# EasyEDA Pro project 测试用途.eprj, board PCB3
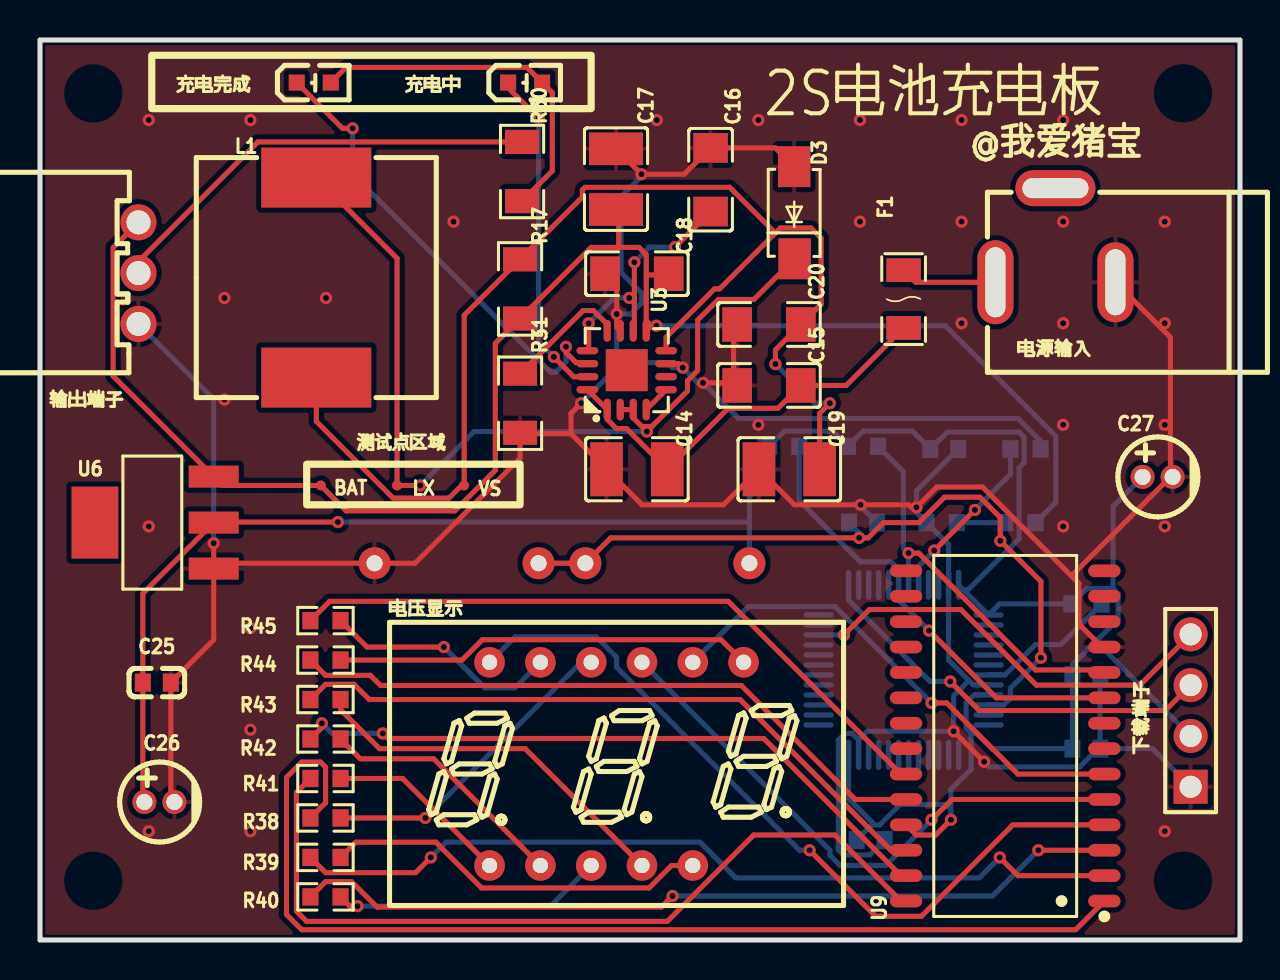
[diagram p9: board, top side]
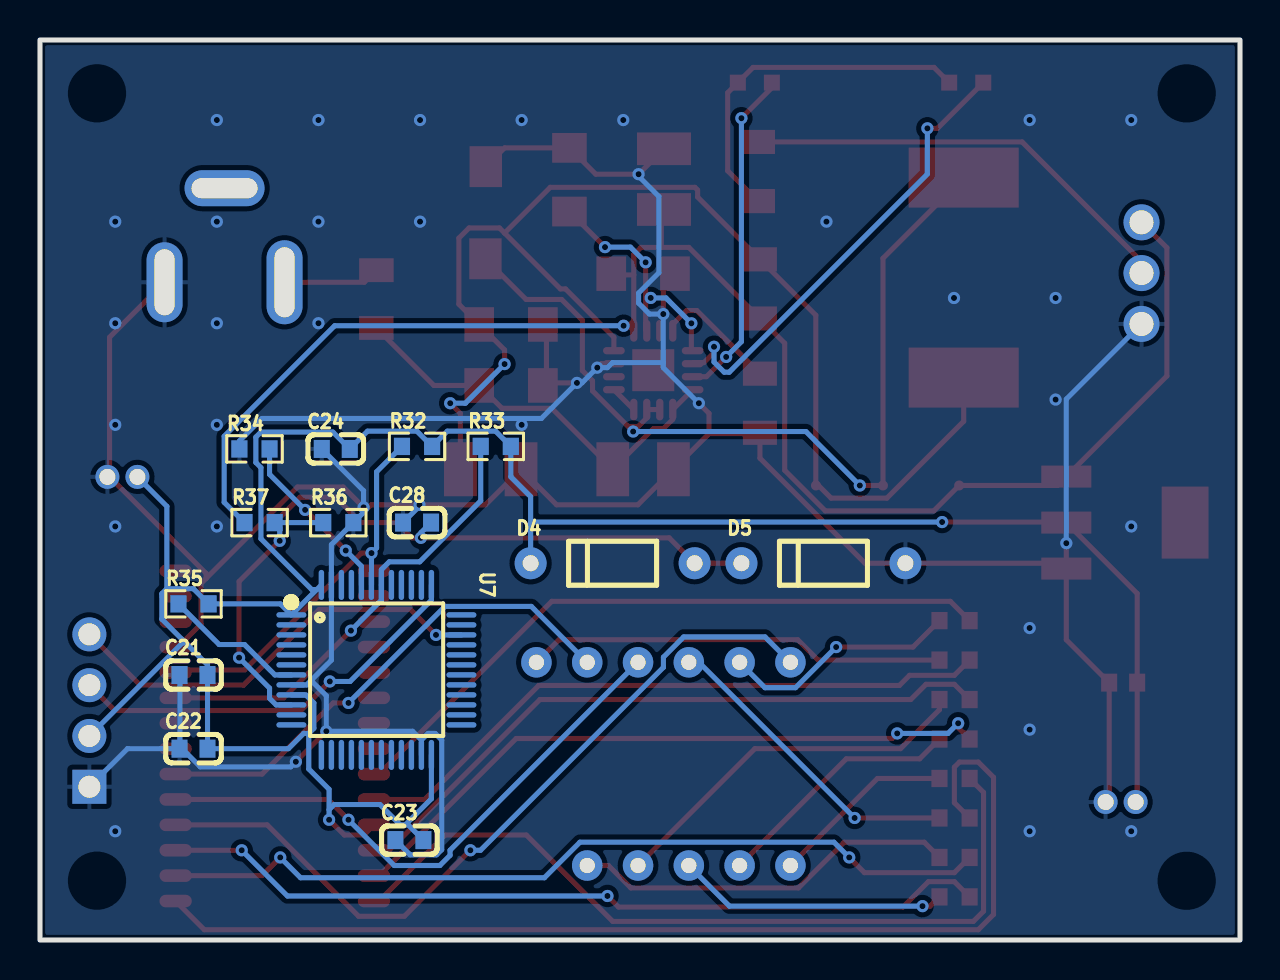
[diagram p10: board, bottom side, seen from below]

Outline 60 x 45 mm; copper layers: Top Layer, Bottom Layer. Coordinates in mm from the lower left corner of the outline.
Outline path: rectangle 0,45 60,0
Stack: Top Layer 0.035mm / Dielectric1 1.51mm FR4 er 4.5 / Bottom Layer 0.035mm

## Design rules (mm)
template: JLCPCB Capability(Two Layers Board)
spacing copperThickness1oz (default): track to track 0.102, other pairs 0.152 to 0.3
spacing copperThickness2oz: track to track 0.203, other pairs 0.152 to 0.3
track width copperThickness1oz (default): min 0.127, default 0.254, max 2.54
track width copperThickness2oz: min 0.203, default 0.254, max 2.54
differential pair differentialPair (default): width min 0.127, default 0.254, max 2.54; gap min 0.152, default 0.152
via viaSize (default): diameter min 0.5, default 0.61, max 10; hole min 0.3, default 0.305, max 6.3

## Placement (name value [footprint] x y rotation side)
BAT  -  [Test-Point-0.5mm]  14.04 22.73 180 top
C14  10UF  [C1210]  29.85 23.54 180 top
C15  100nf  [C1206]  36.45 27.73 0 top
C16  10UF  [C1206]  33.53 38.02 270 top
C17  10UF  [C1210]  28.8 38.04 90 top
C18  100nf  [C1206]  29.85 33.32 0 top
C19  10UF  [C1210]  37.47 23.54 180 top
C20  100nf  [C1206]  36.45 30.78 0 top
C21  100nF  [C0603]  52.32 13.25 180 bottom
C22  100nF  [C0603]  52.32 9.57 180 bottom
C23  100nF  [C0603]  41.53 5 180 bottom
C24  100nF  [C0603]  45.21 24.55 180 bottom
C25  100nF  [C0603]  5.84 12.87 180 top
C26  4.7uF  [CAP-TH_BD4.0-P1.50-D0.5-FD]  5.97 6.9 0 top
C27  4.7uF  [CAP-TH_BD4.0-P1.50-D0.5-FD]  55.88 23.16 0 top
C28  100nF  [C0603]  41.15 20.87 180 bottom
D3  SS14  [SMA_L4.3-W2.6-LS5.0-FD]  37.72 36.36 270 top
D4  1N4148  [DO-35_BD2.0-L4.2-P8.20-D0.5-RD]  31.37 18.84 180 bottom
D5  1N4148  [DO-35_BD2.0-L4.2-P8.20-D0.5-RD]  20.83 18.84 180 bottom
F1  SMD1206  [F1206]  43.18 32.05 90 top
L1  22uH  [IND-SMD_L12.0-W12.0_YPRH120X]  13.82 33.12 90 top
LX  -  [Test-Point-0.5mm]  17.85 22.73 90 top
R17  0.2Ω  [R1206]  24 32.55 90 top
R30  1KΩ  [R1206]  24.1 38.42 270 top
R31  50K  [R1206]  24 26.84 90 top
R32  4.7KΩ  [R0603]  41.15 24.68 180 bottom
R33  4.7KΩ  [R0603]  37.21 24.68 180 bottom
R34  10KΩ  [R0603]  49.28 24.55 180 bottom
R35  10KΩ  [R0603]  52.32 16.81 180 bottom
R36  10KΩ  [R0603]  45.08 20.87 180 bottom
R37  30KΩ  [R0603]  49.02 20.87 180 bottom
R38  200Ω  [R0603]  14.27 6.1 0 top
R39  200Ω  [R0603]  14.27 4.13 0 top
R40  200Ω  [R0603]  14.27 2.16 0 top
R41  200Ω  [R0603]  14.27 8.08 0 top
R42  200Ω  [R0603]  14.27 10.05 0 top
R43  200Ω  [R0603]  14.27 12.02 0 top
R44  200Ω  [R0603]  14.27 14 0 top
R45  200Ω  [R0603]  14.27 15.97 0 top
U3  TP5100  [TQFN-16_L4.0-W4.0-P0.65-BL-EP]  29.34 28.49 0 top
U6  AMS1117-3.3  [SOT-223-3_L6.5-W3.4-P2.30-LS7.0-BR]  5.72 20.87 0 top
U7  STM32F030C8T6TR  [LQFP-48_L7.0-W7.0-P0.50-LS9.0-BL]  43.18 13.5 270 bottom
U9  CH423S  [SOP-28_L17.9-W7.5-P1.27-LS10.3-BL]  48.26 10.2 90 top
VS  -  [Test-Point-0.5mm]  21.2 22.73 270 top
下载端子  PH2.54-01-04PZD  [HDR-TH_4P-P2.54-V-M-1]  57.53 11.47 90 top
充电中  19-217/BHC-ZL1M2RY/3T  [LED0603-R-RD]  24.26 42.87 0 top
充电完成  19-217/BHC-ZL1M2RY/3T  [LED0603-R-RD]  13.69 42.87 0 top
电压显示  FJ3361BH  [LED-SEG-TH_10P-L22.5-W14.0-P2.54-S10.16-BL]  28.83 8.81 0 top
电源输入  DC-005-5A-2.0  [DC-IN-TH_DC-005-5A-2.0]  50.77 35.24 180 top
输出端子  XH-3AW  [CONN-TH_3P-P2.54_HCTL_XH-3AW]  4.93 33.34 90 top

## Footprints (pads in the part's own frame, mm; a bottom-side part is the same pattern mirrored in y, then rotated)
C0603
  rect 0.8x0.9 smd: 1(-0.7,0) 2(0.7,0)
C1206
  rect 1.485x1.728 smd: 1(-1.593,0) 2(1.593,0)
C1210
  rect 1.635x2.7 smd: 1(-1.518,0) 2(1.518,0)
CAP-TH_BD4.0-P1.50-D0.5-FD
  round 1.2 hole 0.8: 1(-0.75,0) 2(0.75,0)
CONN-TH_3P-P2.54_HCTL_XH-3AW
  round 1.8 hole 1.199: 1(-2.54,0) 2(0.002,0) 3(2.54,0)
DC-IN-TH_DC-005-5A-2.0
  oval 1.8x4.2 hole 1x3.5: 1(3,2.352)
  oval 1.8x4 hole 1x3.3: 2(-3,2.352)
  oval 4x1.8 hole 3.3x1: 3(-0.001,-2.352)
DO-35_BD2.0-L4.2-P8.20-D0.5-RD
  round 1.6 hole 0.8: 1(-4.1,0) 2(4.1,0)
F1206
  rect 1.19x1.728 smd: 1(-1.445,0) 2(1.445,0)
HDR-TH_4P-P2.54-V-M-1
  rect 1.7x1.7 hole 1.1: 1(-3.81,0)
  round 1.7 hole 1.1: 2(-1.27,0) 3(1.27,0) 4(3.81,0)
IND-SMD_L12.0-W12.0_YPRH120X
  rect 3x5.5 smd: 1(-5,0) 2(5,0)
LED0603-R-RD
  rect 0.8x0.8 smd: 1(0.851,0) 2(-0.851,0)
LED-SEG-TH_10P-L22.5-W14.0-P2.54-S10.16-BL
  round 1.524 hole 0.762: 1(-6.35,-5.08) 2(-3.81,-5.08) 3(-1.27,-5.08) 4(1.27,-5.08) 5(3.81,-5.08) 7(6.35,5.08) 8(3.81,5.08) 9(1.27,5.08) 10(-1.27,5.08) 11(-3.81,5.08) 12(-6.35,5.08)
LQFP-48_L7.0-W7.0-P0.50-LS9.0-BL
  oval 0.27x1.5 smd: 1(-2.75,-4.25) 2(-2.25,-4.25) 3(-1.75,-4.25) 4(-1.25,-4.25) 5(-0.75,-4.25) 6(-0.25,-4.25) 7(0.25,-4.25) 8(0.75,-4.25) 9(1.25,-4.25) 10(1.75,-4.25) 11(2.25,-4.25) 12(2.75,-4.25) 25(2.75,4.25) 26(2.25,4.25) 27(1.75,4.25) 28(1.25,4.25) 29(0.75,4.25) 30(0.25,4.25) 31(-0.25,4.25) 32(-0.75,4.25) 33(-1.25,4.25) 34(-1.75,4.25) 35(-2.25,4.25) 36(-2.75,4.25)
  oval 1.5x0.27 smd: 13(4.25,-2.75) 14(4.25,-2.25) 15(4.25,-1.75) 16(4.25,-1.25) 17(4.25,-0.75) 18(4.25,-0.25) 19(4.25,0.25) 20(4.25,0.75) 21(4.25,1.25) 22(4.25,1.75) 23(4.25,2.25) 24(4.25,2.75) 37(-4.25,2.75) 38(-4.25,2.25) 39(-4.25,1.75) 40(-4.25,1.25) 41(-4.25,0.75) 42(-4.25,0.25) 43(-4.25,-0.25) 44(-4.25,-0.75) 45(-4.25,-1.25) 46(-4.25,-1.75) 47(-4.25,-2.25) 48(-4.25,-2.75)
R0603
  rect 0.806x0.864 smd: 1(-0.753,0) 2(0.753,0)
R1206
  rect 1.208x1.701 smd: 1(-1.479,0) 2(1.479,0)
SMA_L4.3-W2.6-LS5.0-FD
  rect 2.046x1.62 smd: 1(-2.304,-0.009) 2(2.304,0.009)
SOP-28_L17.9-W7.5-P1.27-LS10.3-BL
  oval 0.63x1.615 smd: 1(-8.255,-4.957) 2(-6.985,-4.957) 3(-5.715,-4.957) 4(-4.445,-4.957) 5(-3.175,-4.957) 6(-1.905,-4.957) 7(-0.635,-4.957) 8(0.635,-4.957) 9(1.905,-4.957) 10(3.175,-4.957) 11(4.445,-4.957) 12(5.715,-4.957) 13(6.985,-4.957) 14(8.255,-4.957) 15(8.255,4.957) 16(6.985,4.957) 17(5.715,4.957) 18(4.445,4.957) 19(3.175,4.957) 20(1.905,4.957) 21(0.635,4.957) 22(-0.635,4.957) 23(-1.905,4.957) 24(-3.175,4.957) 25(-4.445,4.957) 26(-5.715,4.957) 27(-6.985,4.957) 28(-8.255,4.957)
SOT-223-3_L6.5-W3.4-P2.30-LS7.0-BR
  rect 2.5x1.1 smd: 1(2.97,-2.3) 2(2.97,0) 3(2.97,2.3)
  rect 2.34x3.6 smd: 4(-2.97,0)
Test-Point-0.5mm
  round 0.5 smd: 1(0,0)
TQFN-16_L4.0-W4.0-P0.65-BL-EP
  oval 0.364x1.087 smd: 1(-0.975,-1.968) 2(-0.325,-1.968) 3(0.325,-1.968) 4(0.975,-1.968) 9(0.975,1.968) 10(0.325,1.968) 11(-0.325,1.968) 12(-0.975,1.968)
  oval 1.087x0.364 smd: 5(1.968,-0.975) 6(1.968,-0.325) 7(1.968,0.325) 8(1.968,0.975) 13(-1.968,0.975) 14(-1.968,0.325) 15(-1.968,-0.325) 16(-1.968,-0.975)
  rect 2.1x2.1 smd: 17(0,0)

## Nets
As in the schematic.

Pads without a net: U3 6 17; U6 4; U7 2 3 4 5 6 11 12 13 14 15 16 17 18 19 20 21 22 25 26 27 28 29 30 31 32 33 35 36 38 39 40 41 45 46; U9 7 8 12 13 14 15 16 17 18 19 20 21 22; 电源输入 3

## Via types
v1: diameter 0.61, hole 0.305, Top Layer to Bottom Layer, 75 vias

## Routing (per net, layer and track width the routed paths; a pad name or vN(x,y) marks a point on that pad's centre or on a via; arc(x,y) is an arc through that point)
3V3: length 128.4
  Top Layer w0.254: C26.1 5.14,6.98 C25.2 5.14,17.33 U6.2 8.71,20.9 v1(14.89,20.9) ; U9.25 43.81,5.25 44.78,5.25 v1(45.55,6.01)
  Bottom Layer w0.254: U7.24 40.43,7.06 41.73,5.76 ; 41.73,5.76 41.59,5.76 C23.2 ; 41.73,5.76 41.99,5.76 43.01,6.77 45.29,6.77 45.55,6.52 ; 52.89,15.03 52.89,14.84 57.53,10.2 ; 52.89,15.03 51.62,13.76 C21.2 C22.2 47.58,9.57 46.82,10.33 46.56,10.33 ; 52.89,15.03 53.91,16.04 53.91,17.31 53.66,17.57 ; 46.56,10.33 46.31,10.58 46.31,11.85 46.71,12.25 U7.9 ; 46.56,10.33 46.56,8.55 45.55,7.54 45.55,6.52 ; 53.66,17.57 53.66,21.68 C27.1 ; 53.66,17.57 52.33,17.57 R35.2 47.98,16.81 U7.1 46.16,17.52 ; 45.55,6.52 v1(45.55,6.01) ; 46.16,17.52 U7.48 ; 46.16,17.52 46.41,17.52 48.95,20.06 48.95,23.62 49.21,23.87 49.21,25.14 48.95,25.4 45.36,25.4 C24.2 43.62,25.44 41.16,25.44 R32.2 39.63,25.44 37.22,25.44 R33.2 36.46,23.16 35.47,22.17 35.47,20.9 ; 35.47,20.9 v1(14.89,20.9) ; 35.47,20.9 D4.1
GND: length 209.9
  Top Layer w0.254: 电源输入.2 56.52,30.14 56.52,23.16 ; 26.55,25.31 26.55,26.33 v1(27.06,26.84) ; 26.55,25.31 24.05,25.31 R31.1 24,24.09 18.75,18.84 D5.2 8.95,18.84 U6.1 ; 26.55,25.31 C14.2 30.11,21.76 34.17,21.76 C19.2 37.73,21.76 v1(41.03,21.76) 43.44,21.76 43.57,21.63 v1(43.82,21.63) 44.84,22.65 47.12,22.65 51.7,18.08 ; 51.7,18.08 51.7,18.33 56.52,23.16 ; 51.7,18.08 51.95,17.82 51.95,15.79 53.09,14.65 U9.11 ; C26.2 6.54,7.08 C25.1 8.69,15.01 U6.1 ; 56.52,23.16 C27.2 ; v1(32.14,28.62) 31.94,28.81 U3.7 ; v1(33.15,27.86) 34.68,27.86 ; 34.68,27.86 34.68,30.6 C20.1 ; 34.68,27.86 C15.1 ; C17.2 v1(30.07,38.29) 32.21,38.29 C16.1 36.77,39.61 D3.1 ; U6.1 v1(8.69,19.84) ; v1(45.68,10.44) v1(47.21,8.91) ; U3.11 28.84,30.64 v1(28.84,31.3) 28.84,32.73 C18.1
  Bottom Layer w0.254: 46.45,12.98 45.68,12.21 v1(45.68,10.44) 41.37,10.44 40.93,10 ; 46.45,12.98 46.67,12.75 U7.8 ; 46.45,12.98 45.43,13.99 U7.47 45.43,19.77 R36.2 43.82,21.38 v1(43.82,21.63) 43.82,22.46 C24.1 ; v1(8.69,19.84) 8.69,27.04 输出端子.1 ; 28.84,28.87 28.84,28.62 v1(27.06,26.84) ; 28.84,28.87 31.38,28.87 31.63,28.62 v1(32.14,28.62) 32.9,27.86 v1(33.15,27.86) 34.93,26.08 48.9,26.08 50.03,24.95 R34.1 ; 28.84,28.87 v1(28.84,31.3) 29.53,31.3 30.07,31.84 30.07,32.35 29.05,33.37 29.05,37.18 30.07,38.19 v1(30.07,38.29) ; 53,9.67 53,13.23 53.02,13.25 ; 53,9.67 53,9.59 53.02,9.57 55.63,9.57 下载端子.1 ; 53,9.67 51.99,8.66 47.46,8.66 v1(47.21,8.91) ; C23.1 41.5,4.26 40.17,4.26 39.91,4.52 39.91,10 40.24,10.33 40.6,10.33 40.93,10 ; 40.93,10 U7.23 ; C28.1 41.03,21.69 v1(41.03,21.76)
  vias: v1(5.44,41) v1(5.44,20.68) v1(5.44,5.44) v1(9.22,32.1) v1(9.22,27.02) v1(10.52,41) v1(10.52,15.6) v1(10.52,10.52) v1(10.52,5.44) v1(14.3,32.1) v1(20.68,35.92) v1(30.84,41) v1(35.92,41) v1(35.92,25.76) v1(41,41) v1(41,35.92) v1(46.08,41) v1(46.08,35.92) v1(46.08,30.84) v1(51.16,41) v1(51.16,35.92) v1(51.16,30.84) v1(51.16,25.76) v1(51.16,20.68) v1(56.24,35.92) v1(56.24,30.84) v1(56.24,25.76) v1(56.24,20.68) v1(56.24,5.44)
VCC: length 20.7
  Top Layer w0.254: U3.16 U3.1 28.36,26.03 28.82,25.57 29.33,25.57 C14.1 34.41,26.59 36.9,26.59 C15.2 40.31,27.73 F1.1
GRID1: length 39.2
  Top Layer w0.254: v1(38.48,4.49) 41.78,1.19 44.07,1.19 48.64,5.76 U9.4
  Bottom Layer w0.254: 电压显示.12 23.75,15.16 27.81,15.16 28.83,14.14 28.83,13.63 37.97,4.49 v1(38.48,4.49)
GRID2: length 28.8
  Top Layer w0.254: U9.5 45.59,7.03 v1(44.58,6.01)
  Bottom Layer w0.254: 电压显示.9 39.5,4.49 39.5,4.23 40.01,3.73 42.29,3.73 v1(44.58,6.01)
GRID3: length 25.2
  Top Layer w0.254: U9.6 48.89,8.3 45.34,11.85 v1(44.58,11.85)
  Bottom Layer w0.254: 电压显示.8 35.43,16.68 39.75,16.68 v1(44.58,11.85)
PA0: length 41
  Top Layer w0.254: v1(50.05,14.12) 50.05,17.93 v1(48.01,19.96) 48.01,21.12 47,22.14 45.22,22.14 43.95,20.87 42.17,20.87 41.41,20.11 v1(40.96,20.11) 28.54,20.11 D4.2 D5.1
  Bottom Layer w0.254: C28.2 40.96,20.36 v1(40.96,20.11) ; R36.1 R37.2 48.01,20.62 v1(48.01,19.96) ; U7.10 48.19,11.75 48.52,12.08 48.52,12.59 v1(50.05,14.12)
S1: length 33.8
  Top Layer w0.254: R45.1 14.48,16.93 34.41,16.93 43.05,8.3 U9.23
S2: length 32.7
  Top Layer w0.254: U9.24 40.76,7.03 35.06,12.73 17.03,12.73 16.52,13.23 14.28,13.23 R44.1
S3: length 33.5
  Top Layer w0.254: R43.1 14.28,12.79 15.7,12.79 16.46,12.02 35,12.02 42.54,4.49 U9.26
S4: length 33.4
  Top Layer w0.254: v1(14.09,10.84) 14.09,10.62 R42.1 ; v1(17.14,10.33) 17.39,10.08 36.19,10.08 43.05,3.22 U9.27
  Bottom Layer w0.254: v1(14.09,10.84) 14.6,10.33 v1(17.14,10.33)
S5: length 40.8
  Top Layer w0.254: U9.28 43.05,1.95 39.75,5.25 35.68,5.25 31.36,0.93 13.33,0.93 12.82,1.44 12.82,7.38 R41.1
S6: length 53.9
  Top Layer w0.254: R38.1 14.28,6.86 14.28,8.64 14.03,8.9 13.09,8.9 12.32,8.13 12.32,1.28 13.09,0.51 51.78,0.51 U9.1
S7: length 42.2
  Top Layer w0.254: v1(19.54,4.13) 18.78,3.37 14.28,3.37 R39.1 ; U9.2 48.9,3.22 v1(47.99,4.13)
  Bottom Layer w0.254: v1(19.54,4.13) 20.3,4.89 33,4.89 34.78,3.11 46.97,3.11 v1(47.99,4.13)
S8: length 41.7
  Top Layer w0.254: U9.3 v1(49.92,4.49) ; v1(31.63,2.2) 31.07,1.65 16.85,1.65 15.58,2.92 14.28,2.92 R40.1
  Bottom Layer w0.254: v1(31.63,2.2) 47.63,2.2 v1(49.92,4.49)
SCL: length 22.9
  Top Layer w0.254: v1(44.45,15.47) 47.82,12.11 U9.9
  Bottom Layer w0.254: v1(44.45,15.47) 42.93,16.99 U7.42 42.93,18.52 42.54,18.91 41.01,18.91 37.96,21.96 R33.1
SDA: length 19.8
  Top Layer w0.254: U9.10 53.09,13.5 49.78,13.5 43.93,19.35 v1(43.43,19.35)
  Bottom Layer w0.254: R32.1 43.17,23.41 43.17,19.6 v1(43.43,19.35) 43.43,17.76
SEG1: length 11.9
  Top Layer w0.254: v1(20.19,14.65) 16.35,14.65 R45.2
  Bottom Layer w0.254: v1(20.19,14.65) 22.23,12.62 23.75,12.62 电压显示.11
SEG2: length 21
  Top Layer w0.254: R44.2 21.1,14 22.11,15.01 34.05,15.01 电压显示.7
SEG3: length 18.8
  Top Layer w0.254: 电压显示.4 24.26,9.57 16.97,9.57 15.03,11.52 R43.2
SEG4: length 12.6
  Top Layer w0.254: R42.2 16.02,9.06 19.69,9.06 电压显示.2
SEG5: length 9.3
  Top Layer w0.254: R41.2 18.13,8.08 电压显示.1
SEG6: length 15.8
  Top Layer w0.254: v1(19.27,6.1) R38.2
  Bottom Layer w0.254: v1(19.27,6.1) 27.05,13.89 电压显示.10
SEG7: length 19.3
  Top Layer w0.254: R39.2 15.79,4.89 19.79,4.89 22.08,2.6 30.46,2.6 31.58,3.73 电压显示.5
SEG8: length 13.6
  Top Layer w0.254: R40.2 15.49,1.69 v1(15.88,1.69)
  Bottom Layer w0.254: 电压显示.3 25.53,1.69 v1(15.88,1.69)
SWCLK: length 20.7
  Top Layer w0.254: 下载端子.3 56.26,11.47 46.97,11.47 v1(45.51,12.93)
  Bottom Layer w0.254: v1(45.51,12.93) 44.49,12.93 40.43,16.99 U7.37
SWDIO: length 21.7
  Top Layer w0.254: 下载端子.4 54.99,12.74 49.82,12.74 46.04,16.52 41.47,16.52 v1(40.2,15.25)
  Bottom Layer w0.254: U7.34 v1(40.2,15.25)
V-BAT-1S: length 22.2
  Top Layer w0.254: 输出端子.2 4.93,33.93 10.89,39.9 R30.1
V-BAT-2S: length 81.4
  Top Layer w0.254: 30.57,30.71 30.31,30.97 30.31,33.25 ; 30.57,30.71 v1(30.82,30.71) ; 30.57,30.71 U3.9 ; 28.93,34.63 28.93,36.39 C17.1 ; 28.93,34.63 27.56,34.63 R17.1 22.77,29.84 22.77,23.49 20.73,21.46 15.31,21.46 BAT.1 9.13,22.73 U6.3 3.66,28.2 3.66,34.61 输出端子.3 ; 28.93,34.63 29.95,34.63 30.31,34.27 30.31,33.25 ; C18.2 31.37,33.25 30.31,33.25
  Bottom Layer w0.254: v1(30.82,30.71) 45.27,30.71 50.79,25.19 50.79,21.89 R37.1
VOUT: length 1.4
  Top Layer w0.254: U3.4 U3.5
$1N690: length 16.7
  Top Layer w0.254: v1(25.69,29.15) 26.68,28.17 U3.15 ; 充电中.2 23.41,42.62 v1(24.93,41.09)
  Bottom Layer w0.254: v1(25.69,29.15) 24.93,29.92 v1(24.93,41.09)
$1N694: length 45.5
  Top Layer w0.254: v1(19.01,22.73) LX.1 17.85,34.08 L1.2 ; 30.34,25.68 30.09,25.68 29.66,26.1 U3.3 U3.2 ; 30.34,25.68 30.6,25.68 32.37,27.46 32.37,27.96 32.88,28.47 32.88,30.99 33.92,32.03 35.7,32.03 D3.2 ; 30.34,25.68 v1(30.34,25.42)
  Bottom Layer w0.254: v1(19.01,22.73) 21.71,25.42 v1(30.34,25.42)
$1N699: length 12.5
  Top Layer w0.254: v1(27.43,30.83) 27.43,29.53 U3.13 ; 29.72,32.1 v1(29.46,32.1) ; 29.72,32.1 v1(29.72,33.88) ; 29.72,32.1 29.72,30.51 U3.10 ; C16.2 v1(31.75,34.64)
  Bottom Layer w0.254: v1(31.75,34.64) 30.48,34.64 v1(29.72,33.88) ; v1(27.43,30.83) 28.7,32.1 v1(29.46,32.1)
$1N702: length 64.5
  Top Layer w0.254: 21.21,22.86 21.21,22.73 ; 21.21,22.86 20.45,22.09 17.65,22.09 13.82,25.93 L1.1 ; 21.21,22.86 21.21,31.24 R17.2 27.12,37.15 27.12,37.5 27.25,37.63 34.49,37.63 36.77,35.35 ; v1(36.77,28.8) 36.77,29.51 C20.2 39.06,31.79 39.06,35.09 38.55,35.6 37.03,35.6 36.77,35.35 ; 36.77,35.35 33.98,32.55 33.72,32.55 31.31,30.14 U3.8 ; C19.1 38.98,26.33 v1(39.49,26.84)
  Bottom Layer w0.254: v1(36.77,28.8) 38.73,26.84 v1(39.49,26.84)
$1N706: length 23.4
  Top Layer w0.254: 充电完成.2 15.12,40.58 v1(15.63,40.58) ; U3.14 27.32,28.87 26.81,28.87 26.3,29.38 v1(26.3,29.66)
  Bottom Layer w0.254: v1(15.63,40.58) 15.63,38.3 25.54,28.39 25.79,28.39 26.3,28.9 v1(26.3,29.66)
$1N708: length 18
  Top Layer w0.254: 充电完成.1 15.3,43.63 24.35,43.63 25.62,42.36 25.62,38.46 R30.2
$1N712: length 6.3
  Top Layer w0.254: R31.2 27.16,31.47 27.67,31.47 28.36,30.78 U3.12
$1N1690: length 4.8
  Top Layer w0.254: F1.2 43.78,32.89 电源输入.1
$1N9817: length 8.7
  Top Layer w0.254: v1(46.74,21.51) v1(44.71,19.47)
  Bottom Layer w0.254: v1(46.74,21.51) 48.52,23.28 R34.2 ; U7.44 43.93,18.69 v1(44.71,19.47)
$1N9875: length 7.1
  Bottom Layer w0.254: U7.7 48.26,13.25 49.78,14.77 51.05,14.77 R35.1

## Copper pours and planes (outline as drawn; the poured copper is in the pictures)
GND on Top Layer: 67.95,47.31 67.95,-3.77 -6.76,-3.77 -6.76,47.31
GND on Bottom Layer: 69.34,47.57 69.34,-3.39 -7.01,-3.39 -7.01,47.57

## Text on the board
Top Silkscreen Layer: 测试点区域 | @我爱猪宝 | 2S电池充电板
